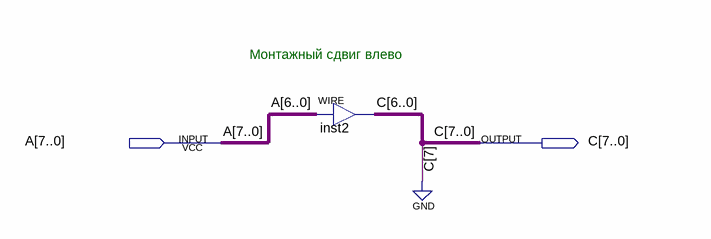
[diagram p0: schematic sheet]
// Quartus schematic SHR_MONTAGE.bdf as structural Verilog: 1 symbols, 2 pins
module SHR_MONTAGE (
  input  [7:0] A,
  output [7:0] C
);

  assign C[6:0] = A[6:0];  // WIRE inst2

  assign C[7] = 1'b0;

  // Notes on the sheet:
  //   Монтажный сдвиг влево
endmodule
